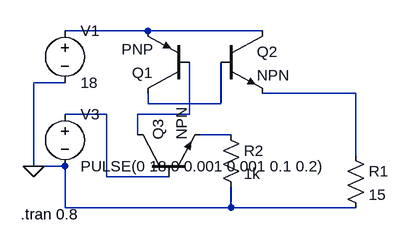
[diagram p0: schematic Sziklai.asc]
Sziklai.asc, the LTspice schematic file:
Version 4
SHEET 1 880 680
WIRE 32 32 -96 32
WIRE 208 32 32 32
WIRE -96 112 -144 112
WIRE 352 128 208 128
WIRE 32 144 32 128
WIRE 144 144 144 80
WIRE 144 144 32 144
WIRE -32 160 -96 160
WIRE 96 160 96 80
WIRE 96 160 16 160
WIRE 16 192 16 160
WIRE 160 192 112 192
WIRE 352 224 352 128
WIRE -144 240 -144 112
WIRE -96 240 -144 240
WIRE -32 256 -32 160
WIRE 64 256 -32 256
WIRE -96 304 -96 240
WIRE 160 304 160 272
WIRE 160 304 -96 304
WIRE 352 304 160 304
FLAG -144 240 0
SYMBOL pnp 96 128 R180
SYMATTR InstName Q1
SYMBOL npn 144 32 R0
SYMATTR InstName Q2
SYMBOL voltage -96 16 R0
WINDOW 123 0 0 Left 2
WINDOW 39 0 0 Left 2
SYMATTR InstName V1
SYMATTR Value 18
SYMBOL voltage -96 144 R0
WINDOW 123 0 0 Left 2
WINDOW 39 0 0 Left 2
SYMATTR InstName V3
SYMATTR Value PULSE(0 18 0 0.001 0.001 0.1 0.2)
SYMBOL res 336 208 R0
SYMATTR InstName R1
SYMATTR Value 15
SYMBOL npn 16 256 R270
SYMATTR InstName Q3
SYMBOL res 144 176 R0
SYMATTR InstName R2
SYMATTR Value 1k
TEXT -164 314 Left 2 !.tran 0.8

The netlist it stands for:
* Sziklai.asc
Q1 N003 N005 N001 0 PNP
Q2 N001 N003 N002 0 NPN
V1 N001 0 18
V3 N004 0 PULSE(0 18 0 0.001 0.001 0.1 0.2)
R1 N002 0 15
Q3 N005 N004 N006 0 NPN
R2 N006 0 1k
.model NPN NPN
.model PNP PNP
.lib standard.bjt
.tran 0.8
.backanno
.end